# EasyEDA Pro project ProDocument_Original_2023-07-23.epro

# Schematic Schematic1_1
Create Date: 2023-07-10; Page Name: P1; Project Name: 39CASTIC; Schematic Name: Schematic1_1; Update Date: 2023-07-20; Add into BOM: yes; Company: 深圳嘉立创科技发展有限公司; Convert to PCB: yes; Drawed: 嘉立创EDA; Page Size: A3; Part Number: JLCPCB-001; Reviewed: 嘉立创EDA; Version: V0.1
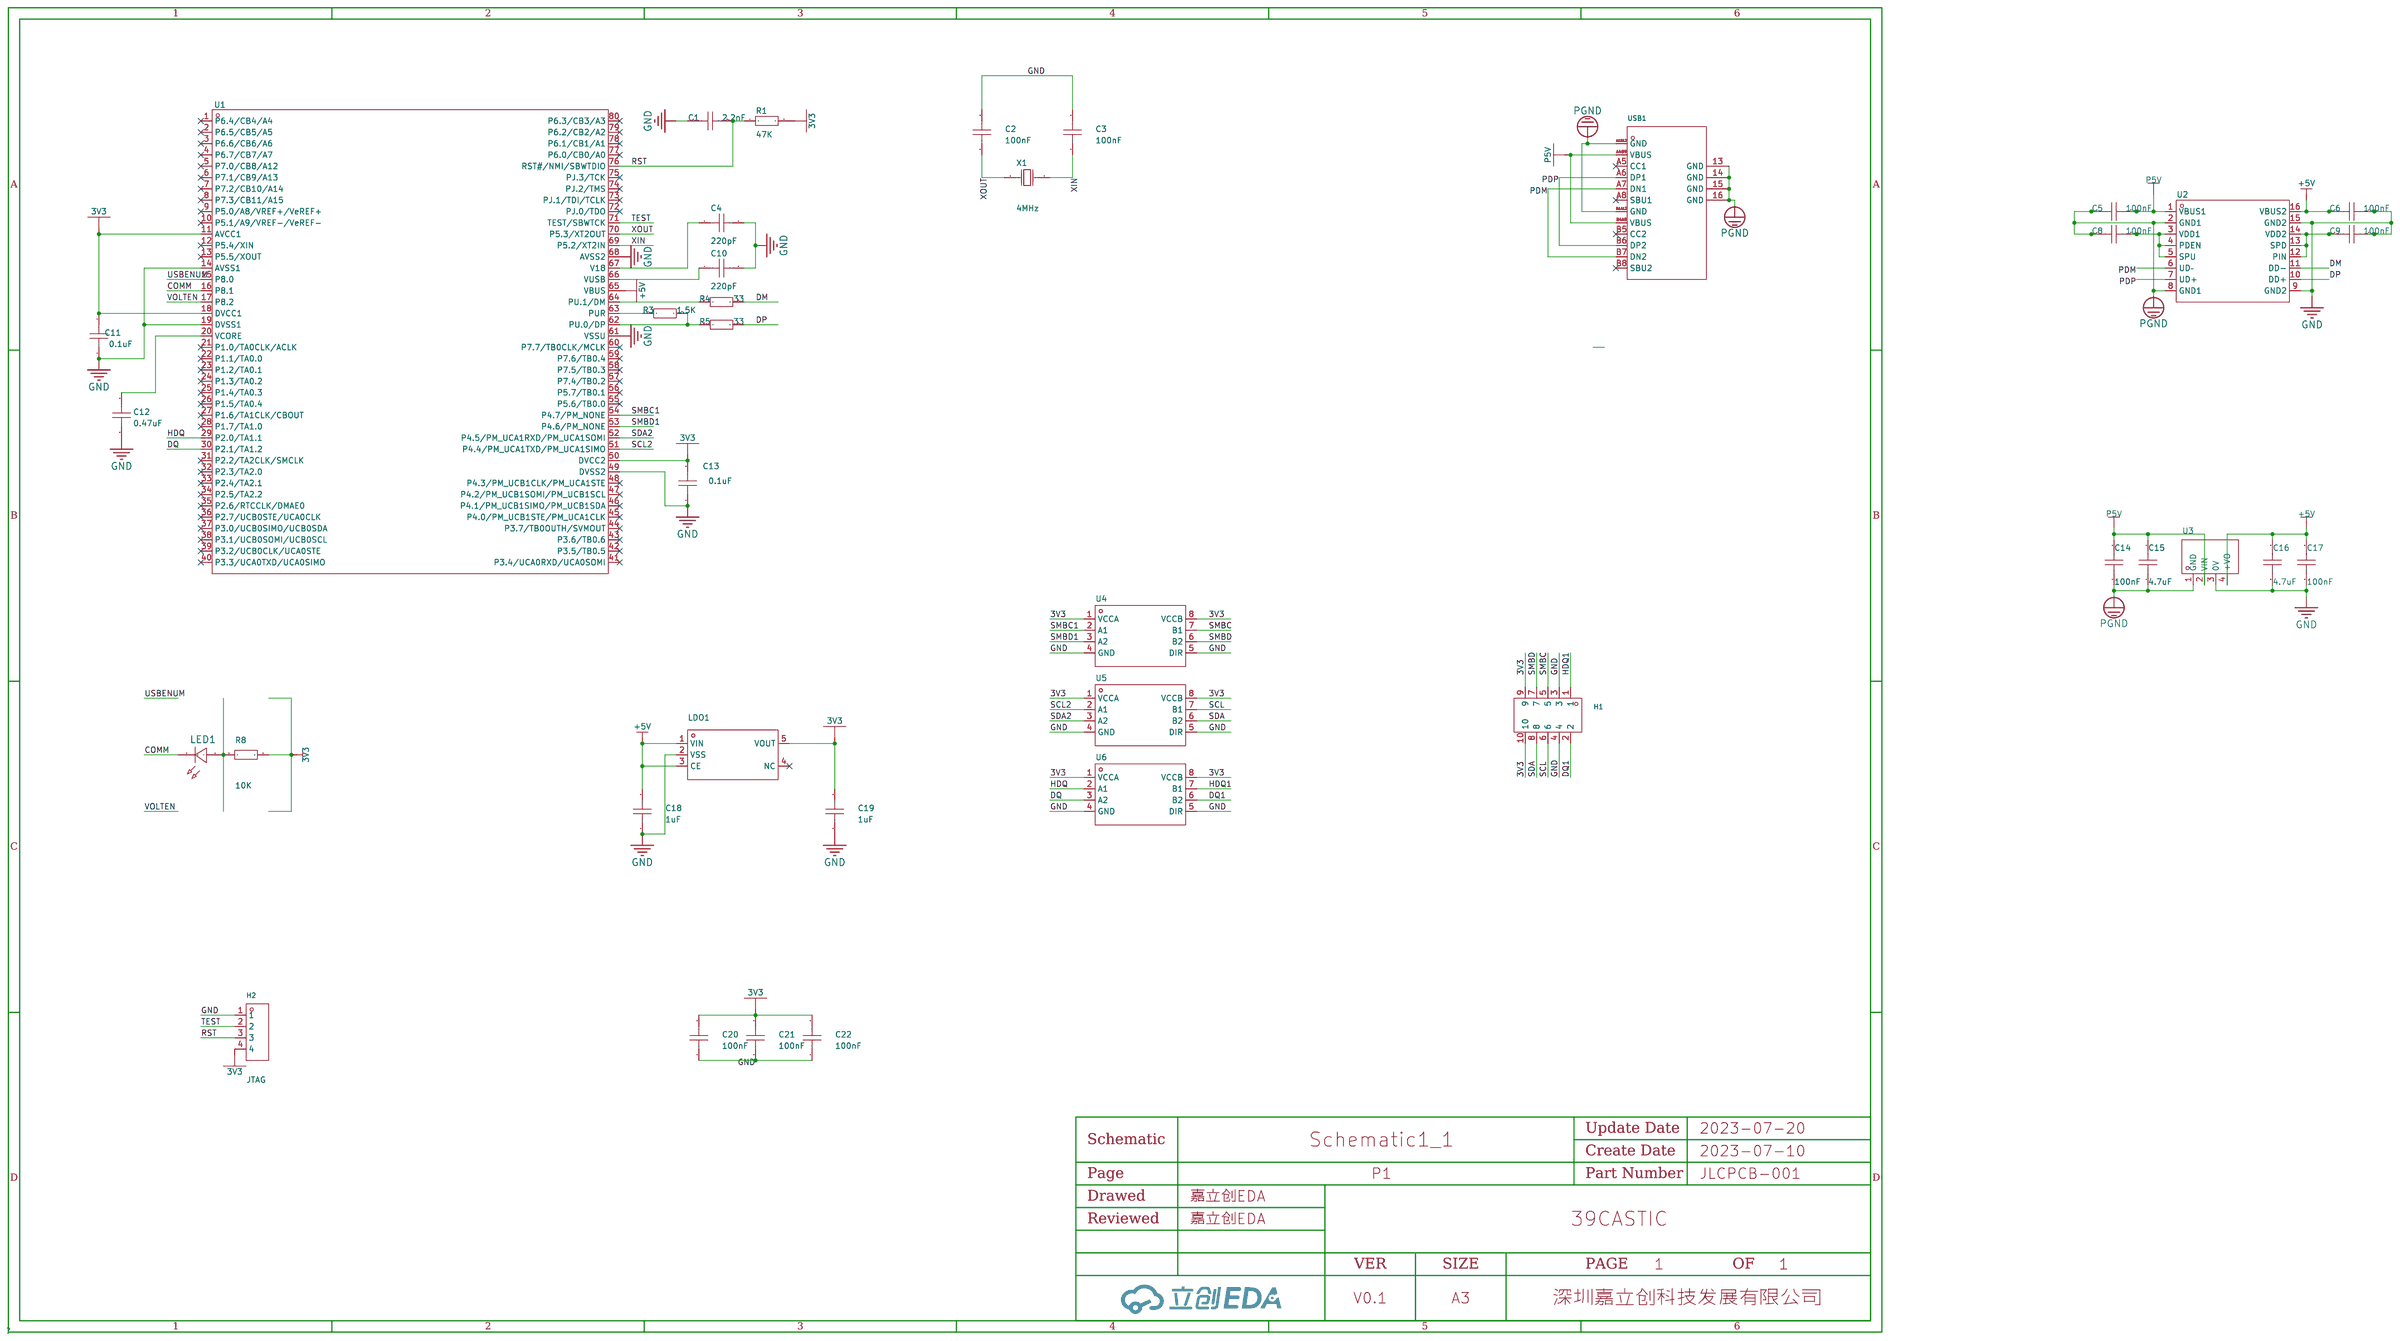
[diagram p0: schematic sheet]

## Parts
C1  2.2nF  [C0603_1]
C2  100nF  [C0603]
C3  100nF  [C0603]
C4  220pF  [C0603_1]
C5  100nF  [C0603]
C6  100nF  [C0603]
C8  100nF  [C0603]
C9  100nF  [C0603]
C10  220pF  [C0603_1]
C11  0.1uF  [C0603_1]
C12  0.47uF  [C0603_1]
C13  0.1uF  [C0603_1]
C14  100nF  [C0603]
C15  4.7uF  [C0603]
C16  4.7uF  [C0603]
C17  100nF  [C0603]
C18  1uF  [C0603]
C19  1uF  [C0603]
C20  100nF  [C0603]
C21  100nF  [C0603]
C22  100nF  [C0603]
H1  PZ254V-12-10P  [HDR-TH_10P-P2.54-V-M-R2-C5-S2.54]
H2  JTAG  [HDR-TH_4P-P2.54-V-F]
LDO1  ME6211C33M5G-N  [SOT-23-5_L3.0-W1.7-P0.95-LS2.8-BL]
LED1  -  [LED_0603]
R1  47K  [R0603_1]
R3  1.5K  [R0603_1]
R4  33  [R0603_1]
R5  33  [R0603_1]
R8  10K  [R0603]
U1  -  [LQFP-80_L12.0-W12.0-P0.50-LS14.0-BL]
U2  ADUM3160BRWZ-RL  [SOIC-16_L10.3-W7.5-P1.27-LS10.3-BL]
U3  B0505S-1W  [PWRM-TH_B0505S-1W]
U4  SN74LVC2T45DCUR  [VSSOP-8_L2.4-W2.1-P0.50-LS3.2-BR]
U5  SN74LVC2T45DCUR  [VSSOP-8_L2.4-W2.1-P0.50-LS3.2-BR]
U6  SN74LVC2T45DCUR  [VSSOP-8_L2.4-W2.1-P0.50-LS3.2-BR]
USB1  TYPEC-304-BCP16  [USB-C-SMD_TYPEC-304-BCP16]
X1  4MHz  [HC-49US_L11.5-W4.5-P4.88]

## Library data of the parts
C1 C4 C10-C13 = CAP_604: 容值:100nF;精度:±10%;额定电压:50V;温度系数:X7R;; Supplier Footprint: 0603
C2 C3 C5 C6 C8 C9 C14-C22 = CAP_0603: Supplier Footprint: 0603
H1 = PZ254V-12-10P: 排数:双排;总PIN位数:10;间距:2.54mm;插针结构:2x5P;行距:2.54mm;安装类型:直插;圆针/方针:方针;额定电流:-;额定电压:-;配合针长度:6mm;塑高:2.5mm;端接针长度:3mm;触头材质:黄铜;触头镀层:-;工作温度范围:-40℃~+105℃;颜色:黑色;; LCSC Part Name: 2.54mm 2x5P 直插 方针; Supplier Part: C492422; Manufacturer: XFCN(兴飞); Supplier Footprint: 直插,P=2.54mm; JLCPCB Part Class: 扩展库; Supplier: LCSC; Number of Rows: 双排; Number of Pins: 10; Pitch: 2.54mm; Pin Structure: 2x5P; Row Spacing: 2.54mm; Mounting Type: 直插; Circluar Pins/Square Pins: 方针; Length of Mating Pin: 6mm; Insulation Height: 2.5mm; Length of End Connection Pin: 3mm; Contact Material: 黄铜; Operating Temperature Range: -40℃~+105℃; Color: 黑色
H2 = HDR-F_2.54_1x4P: Supplier Part: C2718488; Supplier Footprint: 插件
LDO1 = ME6211C33M5G-N: 输出类型:固定;输出极性:正;最大输入电压:6V;输出电压:3.3V;输出电流:500mA;电源纹波抑制比(PSRR):70dB;; Supplier Part: C82942; Manufacturer: MICRONE(南京微盟); Supplier Footprint: SOT-23-5; JLCPCB Part Class: 扩展库; Datasheet: https://atta.szlcsc.com/upload/public/pdf/source/20170918/C82942_1505727073070976520.pdf; Supplier: LCSC; Output Type: 固定; Output Polarity: 正; Number of Outputs: 1; Maximum Input Voltage: 6V; Output Voltage: 3.3V; Dropout Voltage: 260mV@(200mA); Output Current: 500mA; Power Supply Rejection Ratio (PSRR): 70dB
LED1 = LED_0603-R: Supplier Footprint: 0603
R1 R3-R5 = Res_604: Supplier Footprint: 0603
R8 = Res_0603: Supplier Footprint: 0603
U1 = MSP430F5529IPN: CPU位数:-;ROM类型:-;CPU内核:-;主频（MAX):-;工作电压:-;; Supplier Part: C75712; Manufacturer: TI(德州仪器); Supplier Footprint: LQFP-80; JLCPCB Part Class: Extended Part; Datasheet: https://atta.szlcsc.com/upload/public/pdf/source/20180528/C75712_042792AAA7951DA6306D06E7842A7EC0.pdf; Supplier: LCSC
U2 = ADUM3160BRWZ-RL: 隔离器的技术构架:-;类型:-;通道数:-;通道类型:-;隔离电压:-;数据速率:-;; Supplier Part: C284149; Manufacturer: ADI(亚德诺)/LINEAR(凌特); Supplier Footprint: SOIC-16; JLCPCB Part Class: 扩展库; Datasheet: https://atta.szlcsc.com/upload/public/pdf/source/20180910/C284149_11FBD45D63BF8FE73FB2D6895B6D3DA5.pdf; Supplier: LCSC
U3 = B0505S-1W: 电压输出的组数:1;最大输入电压:5.5V;输出电压:5V;输出电流（最大值/满载）:200mA;; LCSC Part Name: DC-DC电源模块; Supplier Part: C2912568; Manufacturer: 德旭电子(DEXU); Supplier Footprint: 插件; JLCPCB Part Class: 扩展库; Datasheet: https://atta.szlcsc.com/upload/public/pdf/source/20211027/5CA00AAE5BD3B5061BF0CC10C720A2B7.pdf; Supplier: LCSC; Type: DC-DC隔离模块; Number of Outputs: 1; Voltage - Input (Min): 4.5V; Voltage - Input (Max): 5.5V; Voltage - Output: 5V; Current - Output(Max): 200mA; Voltage - Isolation: 1.5kVDC
U4-U6 = SN74LVC2T45DCUR: SN74LVC2T45 具有可配置电压转换和三态输出的 2 位双电源总线收发器; Supplier Part: C15741; Manufacturer: TI(德州仪器); Supplier Footprint: VSSOP-8-0.5mm; JLCPCB Part Class: Extended Part; Datasheet: https://atta.szlcsc.com/upload/public/pdf/source/20140711/1457707145874.pdf; Supplier: LCSC
USB1 = TYPEC-304-BCP16_C720629: 连接器类型:Type-C;标准:USB 3.1;公母:母座;触点数量:16;端口数量:1;安装方式:卧贴;额定电流 - 电源:3A;工作温度范围:-25℃~+85℃;焊接温度(最大值):260℃;; LCSC Part Name: Type-C 母座 卧贴 停产; Supplier Part: C720629; Manufacturer: XUNPU(讯普); Supplier Footprint: SMD; JLCPCB Part Class: Extended Part; Supplier: LCSC; Connector Type: Type-C; Standard: USB 3.1; Gender: 母座; Number of Contacts: 16; Number of Ports: 1; Mounting Style: 卧贴; Current Rating - Power (Max): 3A; Operating Temperature Range: -25℃~+85℃; Welding Temperature (Max): 260℃
X1 = X49SD4MSD2SC: 频率:4MHz;频率公差:±20ppm;负载电容:20pF;; LCSC Part Name: 4MHz ±20ppm 20pF HC-49US; Supplier Part: C13761; Manufacturer: YXC(扬兴晶振); Supplier Footprint: HC-49S; JLCPCB Part Class: 扩展库; Datasheet: https://atta.szlcsc.com/upload/public/pdf/source/20210903/A997D130AE99CBB55D9024F9BE6DA174.pdf; Supplier: LCSC; Crystal Type: 49S晶振; Frequency Tolerance: ±20ppm; Frequency Stability: ±30ppm; Load Capacitance: 20pF; Operating Temperature: -20℃~+70℃

## Nets
3V3: C11.2 C13.2 C19.2 C20.2 C21.2 C22.2 H1.9 H1.10 H2.4 LDO1.5(VOUT) R1.2 R8.2 U1.11(AVCC1) U1.18(DVCC1) U1.50(DVCC2) U4.1(VCCA) U4.8(VCCB) U5.1(VCCA) U5.8(VCCB) U6.1(VCCA) U6.8(VCCB)
+5V: C6.1 C16.2 C17.2 C18.2 LDO1.1(VIN) LDO1.3(CE) U1.65(VBUS) U2.16(VBUS2) U3.4(+VO)
GND: C1.1 C2.2 C3.2 C4.2 C6.2 C9.2 C10.2 C11.1 C12.1 C13.1 C16.1 C17.1 C18.1 C19.1 C20.1 C21.1 C22.1 H1.3 H1.4 H2.1 LDO1.2(VSS) U1.14(AVSS1) U1.19(DVSS1) U1.49(DVSS2) U1.61(VSSU) U1.68(AVSS2) U2.9(GND2) U2.15(GND2) U3.3(0V) U4.4(GND) U4.5(DIR) U5.4(GND) U5.5(DIR) U6.4(GND) U6.5(DIR)
P5V: C5.2 C14.2 C15.2 U2.1(VBUS1) U3.2(VIN) USB1.A4B9(VBUS) USB1.B4A9(VBUS)
PGND: C5.1 C8.1 C14.1 C15.1 U2.2(GND1) U2.8(GND1) U3.1(GND) USB1.13(GND) USB1.14(GND) USB1.15(GND) USB1.16(GND) USB1.A1B12(GND) USB1.B1A12(GND)
COMM: LED1.1(C) U1.16(P8.1)
DM: R4.2 U2.11(DD-)
DP: R5.2 U2.10(DD+)
DQ: U1.30(P2.1/TA1.2) U6.3(A2)
DQ1: H1.2 U6.6(B2)
HDQ: U1.29(P2.0/TA1.1) U6.2(A1)
HDQ1: H1.1 U6.7(B1)
PDM: U2.6(UD–) USB1.A7(DN1) USB1.B7(DN2)
PDP: U2.7(UD+) USB1.A6(DP1) USB1.B6(DP2)
RST: C1.2 H2.3 R1.1 U1.76(RST#/NMI/SBWTDIO)
SCL: H1.6 U5.7(B1)
SCL2: U1.51(P4.4/PM_UCA1TXD/PM_UCA1SIMO) U5.2(A1)
SDA: H1.8 U5.6(B2)
SDA2: U1.52(P4.5/PM_UCA1RXD/PM_UCA1SOMI) U5.3(A2)
SMBC: H1.5 U4.7(B1)
SMBC1: U1.54(P4.7/PM_NONE) U4.2(A1)
SMBD: H1.7 U4.6(B2)
SMBD1: U1.53(P4.6/PM_NONE) U4.3(A2)
TEST: H2.2 U1.71(TEST/SBWTCK)
USBENUM: U1.15(P8.0)
VOLTEN: U1.17(P8.2)
XIN: C3.1 U1.69(P5.2/XT2IN) X1.1(OSC1)
XOUT: C2.1 U1.70(P5.3/XT2OUT) X1.2(OSC2)
$1N1515: C12.2 U1.20(VCORE)
$1N2214: R3.2 R5.1 U1.62(PU.0/DP)
$1N2405: R3.1 U1.63(PUR)
$1N2629: R4.1 U1.64(PU.1/DM)
$1N2974: C10.1 U1.66(VUSB)
$1N2990: C4.1 U1.67(V18)
$1N10159: C8.2 U2.3(VDD1) U2.4(PDEN) U2.5(SPU)
$1N10160: C9.1 U2.12(PIN) U2.13(SPD) U2.14(VDD2)
$1N11086: LED1.2(A) R8.1

Not connected (* = marked no-connect by the designer): LDO1 4(NC)*; U1 1(P6.4/CB4/A4)* 2(P6.5/CB5/A5)* 3(P6.6/CB6/A6)* 4(P6.7/CB7/A7)* 5(P7.0/CB8/A12)* 6(P7.1/CB9/A13)* 7(P7.2/CB10/A14)* 8(P7.3/CB11/A15)* 9(P5.0/A8/VREF+/VeREF+)* 10(P5.1/A9/VREF-/VeREF-)* 12(P5.4/XIN)* 13(P5.5/XOUT)* 21(P1.0/TA0CLK/ACLK)* 22(P1.1/TA0.0)* 23(P1.2/TA0.1)* 24(P1.3/TA0.2)* 25(P1.4/TA0.3)* 26(P1.5/TA0.4)* 27(P1.6/TA1CLK/CBOUT)* 28(P1.7/TA1.0)* 31(P2.2/TA2CLK/SMCLK)* 32(P2.3/TA2.0)* 33(P2.4/TA2.1)* 34(P2.5/TA2.2)* 35(P2.6/RTCCLK/DMAE0)* 36(P2.7/UCB0STE/UCA0CLK)* 37(P3.0/UCB0SIMO/UCB0SDA)* 38(P3.1/UCB0SOMI/UCB0SCL)* 39(P3.2/UCB0CLK/UCA0STE)* 40(P3.3/UCA0TXD/UCA0SIMO)* 41(P3.4/UCA0RXD/UCA0SOMI)* 42(P3.5/TB0.5)* 43(P3.6/TB0.6)* 44(P3.7/TB0OUTH/SVMOUT)* 45(P4.0/PM_UCB1STE/PM_UCA1CLK)* 46(P4.1/PM_UCB1SIMO/PM_UCB1SDA)* 47(P4.2/PM_UCB1SOMI/PM_UCB1SCL)* 48(P4.3/PM_UCB1CLK/PM_UCA1STE)* 55(P5.6/TB0.0)* 56(P5.7/TB0.1)* 57(P7.4/TB0.2)* 58(P7.5/TB0.3)* 59(P7.6/TB0.4)* 60(P7.7/TB0CLK/MCLK)* 72(PJ.0/TDO)* 73(PJ.1/TDI/TCLK)* 74(PJ.2/TMS)* 75(PJ.3/TCK)* 77(P6.0/CB0/A0)* 78(P6.1/CB1/A1)* 79(P6.2/CB2/A2)* 80(P6.3/CB3/A3)*; USB1 A5(CC1)* A8(SBU1)* B5(CC2)* B8(SBU2)*

# Board PCB1_1
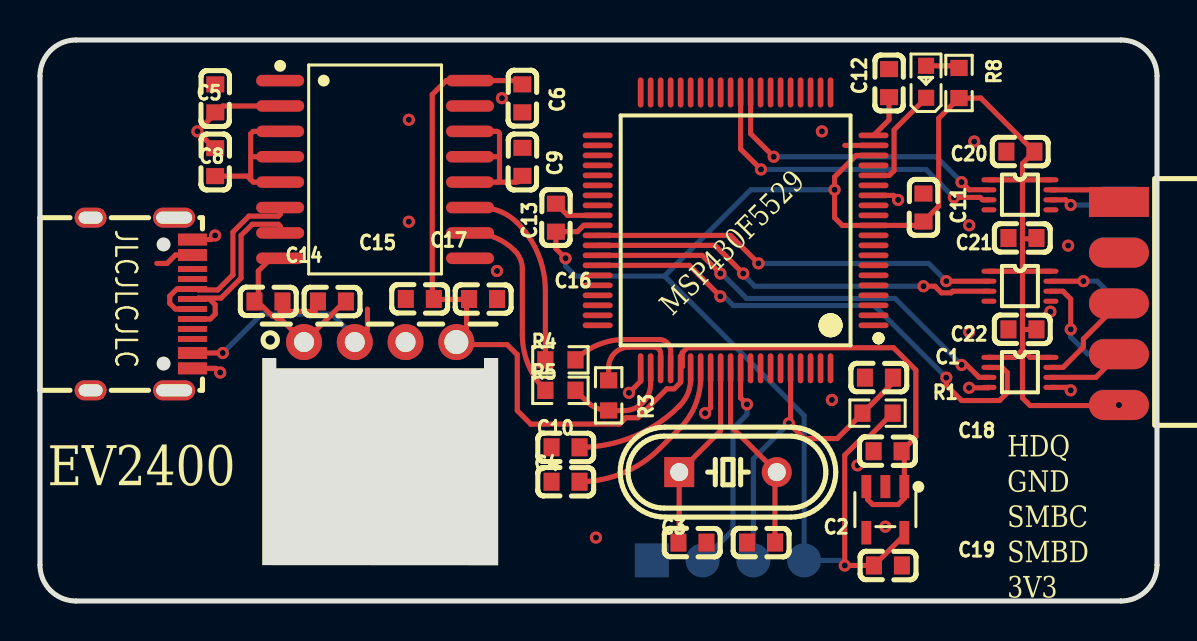
[diagram p1: board, top side]
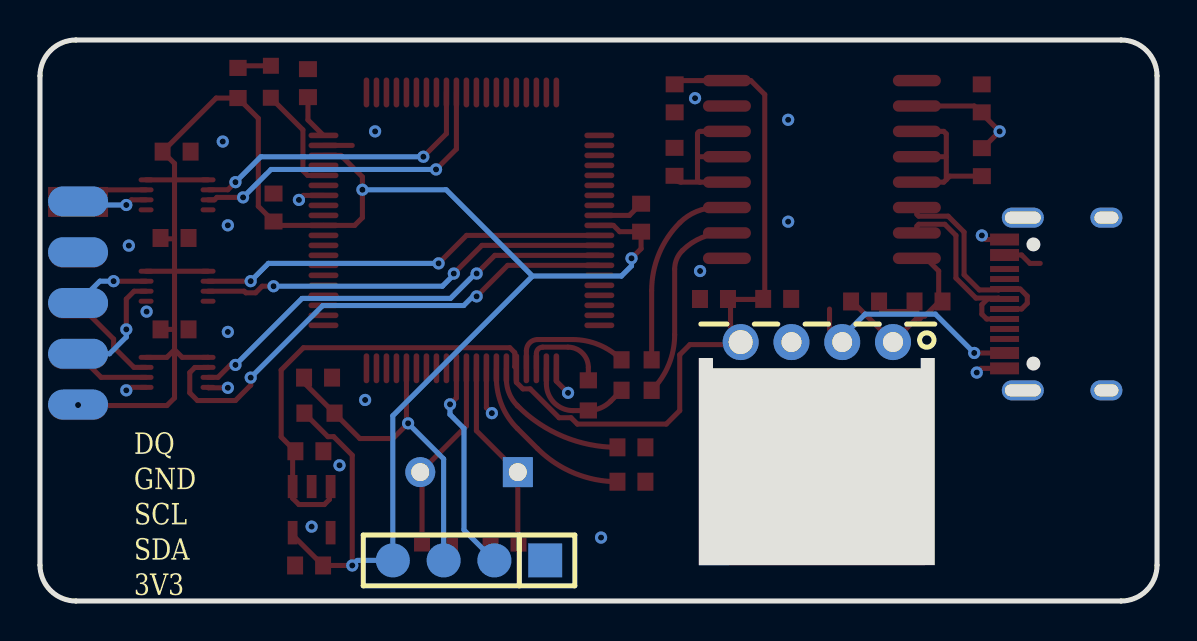
[diagram p2: board, bottom side, seen from below]

Outline 55.88 x 28.07 mm; copper layers: Top Layer, Bottom Layer. Coordinates in mm from the lower left corner of the outline.
Outline path: 0,26.27 0,1.8 arc(0.53,0.53) 1.8,0 54.08,0 arc(55.35,0.53) 55.88,1.8 55.88,26.27 arc(55.35,27.54) 54.08,28.07 1.8,28.07 arc(0.53,27.54) 0,26.27
Stack: Top Layer 0.035mm / Dielectric1 1.51mm FR4 er 4.5 / Bottom Layer 0.035mm

## Design rules (mm)
net DP: DP2
net DM: DP2
net PDP: DP1
net PDM: DP1
template: JLCPCB Capability(Two Layers Board)
spacing copperThickness1oz (default): track to track 0.102, other pairs 0.152 to 0.3
spacing copperThickness2oz: track to track 0.203, other pairs 0.152 to 0.3
track width copperThickness1oz (default): min 0.127, default 0.254, max 2.54
track width copperThickness2oz: min 0.203, default 0.254, max 2.54
differential pair differentialPair (default): width min 0.127, default 0.254, max 2.54; gap min 0.152, default 0.152
via viaSize (default): diameter min 0.5, default 0.61, max 10; hole min 0.3, default 0.305, max 6.3

## Placement (name value [footprint] x y rotation side)
C1  2.2nF  [C0603_1]  41.97 11.18 0 top
C2  100nF  [C0603]  36.07 2.93 180 top
C3  100nF  [C0603]  32.64 2.92 0 top
C4  220pF  [C0603_1]  26.29 5.97 180 top
C5  100nF  [C0603]  8.77 25.15 90 top
C6  100nF  [C0603]  24.13 25.15 270 top
C8  100nF  [C0603]  8.76 21.96 270 top
C9  100nF  [C0603]  24.14 21.97 90 top
C10  220pF  [C0603_1]  26.29 7.69 180 top
C11  0.1uF  [C0603_1]  44.2 19.68 270 top
C12  0.47uF  [C0603_1]  42.47 25.91 270 top
C13  0.1uF  [C0603_1]  25.81 19.18 270 top
C14  100nF  [C0603]  11.43 14.99 0 top
C15  4.7uF  [C0603]  14.61 14.99 180 top
C16  4.7uF  [C0603]  22.16 15.11 180 top
C17  100nF  [C0603]  19 15.11 0 top
C18  1uF  [C0603]  42.4 7.49 0 top
C19  1uF  [C0603]  42.42 1.78 180 top
C20  100nF  [C0603]  49.05 22.48 0 top
C21  100nF  [C0603]  49.15 18.16 0 top
C22  100nF  [C0603]  49.15 13.59 0 top
H1  PZ254V-12-10P  [HDR-TH_10P-P2.54-V-M-R2-C5-S2.54]  55.24 14.88 270 top
H2  JTAG  [HDR-TH_4P-P2.54-V-F]  34.42 2.03 0 bottom
LDO1  ME6211C33M5G-N  [SOT-23-5_L3.0-W1.7-P0.95-LS2.8-BL]  42.29 4.57 180 top
LED1  -  [LED_0603]  44.32 26.03 90 top
R1  47K  [R0603_1]  41.9 9.4 0 top
R3  1.5K  [R0603_1]  28.45 10.29 270 top
R4  33  [R0603_1]  26.04 12.06 180 top
R5  33  [R0603_1]  26.04 10.54 180 top
R8  10K  [R0603]  45.97 25.92 270 top
U1  -  [LQFP-80_L12.0-W12.0-P0.50-LS14.0-BL]  34.8 18.54 90 top
U2  ADUM3160BRWZ-RL  [SOIC-16_L10.3-W7.5-P1.27-LS10.3-BL]  16.76 21.59 270 top
U3  B0505S-1W  [PWRM-TH_B0505S-1W]  17.02 12.95 0 bottom
U4  SN74LVC2T45DCUR  [VSSOP-8_L2.4-W2.1-P0.50-LS3.2-BR]  49.02 11.44 180 top
U5  SN74LVC2T45DCUR  [VSSOP-8_L2.4-W2.1-P0.50-LS3.2-BR]  49.02 15.75 180 top
U6  SN74LVC2T45DCUR  [VSSOP-8_L2.4-W2.1-P0.50-LS3.2-BR]  49.02 20.32 180 top
USB1  TYPEC-304-BCP16  [USB-C-SMD_TYPEC-304-BCP16]  5.08 14.86 270 top
X1  4MHz  [HC-49US_L11.5-W4.5-P4.88]  34.42 6.45 0 top

## Footprints (pads in the part's own frame, mm; a bottom-side part is the same pattern mirrored in y, then rotated)
C0603
  rect 0.8x0.9 smd: 1(-0.7,0) 2(0.7,0)
C0603_1
  rect 0.8x0.9 smd: 1(-0.7,0) 2(0.7,0)
HC-49US_L11.5-W4.5-P4.88
  rect 1.5x1.5 hole 0.9: 1(-2.44,0)
  round 1.5 hole 0.9: 2(2.44,0)
HDR-TH_4P-P2.54-V-F
  rect 1.7x1.7 smd: 1(-3.81,0)
  round 1.7 smd: 2(-1.27,0) 3(1.27,0) 4(3.81,0)
HDR-TH_10P-P2.54-V-M-R2-C5-S2.54
  rect 1.5x3 smd: 1(-5.08,-1.27)
  oval 1.5x3 smd far side: 2(-5.106,-1.27) 4(-2.566,-1.27) 6(-0.025,-1.27) 8(2.514,-1.27) 10(5.054,-1.27)
  oval 1.5x3 smd: 3(-2.54,-1.27) 5(0,-1.27) 7(2.54,-1.27) 9(5.08,-1.27)
LED_0603
  rect 0.8x0.8 smd: 1(-0.851,-0.01) 2(0.75,-0.005)
LQFP-80_L12.0-W12.0-P0.50-LS14.0-BL
  oval 0.28x1.5 smd: 1(-4.75,-6.9) 2(-4.25,-6.9) 3(-3.75,-6.9) 4(-3.25,-6.9) 5(-2.75,-6.9) 6(-2.25,-6.9) 7(-1.75,-6.9) 8(-1.25,-6.9) 9(-0.75,-6.9) 10(-0.25,-6.9) 11(0.25,-6.9) 12(0.75,-6.9) 13(1.25,-6.9) 14(1.75,-6.9) 15(2.25,-6.9) 16(2.75,-6.9) 17(3.25,-6.9) 18(3.75,-6.9) 19(4.25,-6.9) 20(4.75,-6.9) 41(4.75,6.9) 42(4.25,6.9) 43(3.75,6.9) 44(3.25,6.9) 45(2.75,6.9) 46(2.25,6.9) 47(1.75,6.9) 48(1.25,6.9) 49(0.75,6.9) 50(0.25,6.9) 51(-0.25,6.9) 52(-0.75,6.9) 53(-1.25,6.9) 54(-1.75,6.9) 55(-2.25,6.9) 56(-2.75,6.9) 57(-3.25,6.9) 58(-3.75,6.9) 59(-4.25,6.9) 60(-4.75,6.9)
  oval 1.5x0.28 smd: 21(6.9,-4.75) 22(6.9,-4.25) 23(6.9,-3.75) 24(6.9,-3.25) 25(6.9,-2.75) 26(6.9,-2.25) 27(6.9,-1.75) 28(6.9,-1.25) 29(6.9,-0.75) 30(6.9,-0.25) 31(6.9,0.25) 32(6.9,0.75) 33(6.9,1.25) 34(6.9,1.75) 35(6.9,2.25) 36(6.9,2.75) 37(6.9,3.25) 38(6.9,3.75) 39(6.9,4.25) 40(6.9,4.75) 61(-6.9,4.75) 62(-6.9,4.25) 63(-6.9,3.75) 64(-6.9,3.25) 65(-6.9,2.75) 66(-6.9,2.25) 67(-6.9,1.75) 68(-6.9,1.25) 69(-6.9,0.75) 70(-6.9,0.25) 71(-6.9,-0.25) 72(-6.9,-0.75) 73(-6.9,-1.25) 74(-6.9,-1.75) 75(-6.9,-2.25) 76(-6.9,-2.75) 77(-6.9,-3.25) 78(-6.9,-3.75) 79(-6.9,-4.25) 80(-6.9,-4.75)
PWRM-TH_B0505S-1W
  round 1.8 hole 1: 1(-3.81,0) 2(-1.27,0) 3(1.27,0)
  round 1.8 hole 1.2: 4(3.81,0)
R0603
  rect 0.806x0.864 smd: 1(-0.753,0) 2(0.753,0)
R0603_1
  rect 0.806x0.864 smd: 1(-0.753,0) 2(0.753,0)
SOIC-16_L10.3-W7.5-P1.27-LS10.3-BL
  oval 0.574x2.401 smd: 1(-4.445,-4.75) 2(-3.175,-4.75) 3(-1.905,-4.75) 4(-0.635,-4.75) 5(0.635,-4.75) 6(1.905,-4.75) 7(3.175,-4.75) 8(4.445,-4.75) 9(4.445,4.75) 10(3.175,4.75) 11(1.905,4.75) 12(0.635,4.75) 13(-0.635,4.75) 14(-1.905,4.75) 15(-3.175,4.75) 16(-4.445,4.75)
SOT-23-5_L3.0-W1.7-P0.95-LS2.8-BL
  rect 0.49x1.157 smd: 1(-0.95,-1.153) 2(0,-1.153) 3(0.95,-1.153)
  rect 0.49x1.175 smd: 4(0.95,1.153) 5(-0.95,1.153)
USB-C-SMD_TYPEC-304-BCP16
  oval 1x2.1 hole 0.6x1.8: 13(-4.32,1.633) 14(4.32,1.633)
  oval 1x1.6 hole 0.6x1.2: 15(-4.32,-2.547) 16(4.32,-2.547)
  rect 0.6x1.45 smd: A1B12(-3.225,2.547) A4B9(-2.45,2.547) B1A12(3.22,2.547) B4A9(2.45,2.547)
  rect 0.3x1.45 smd: A5(-1.25,2.547) A6(-0.25,2.547) A7(0.25,2.547) A8(1.25,2.547) B5(1.75,2.547) B6(0.75,2.547) B7(-0.75,2.547) B8(-1.75,2.547)
VSSOP-8_L2.4-W2.1-P0.50-LS3.2-BR
  oval 0.75x0.25 smd: 1(1.55,-0.75) 2(1.55,-0.25) 3(1.55,0.25) 4(1.55,0.75) 5(-1.55,0.75) 6(-1.55,0.25) 7(-1.55,-0.25) 8(-1.55,-0.75)

## Nets
As in the schematic.

Pads without a net: LDO1 4; U1 1 2 3 4 5 6 7 8 9 10 12 13 21 22 23 24 25 26 27 28 31 32 33 34 35 36 37 38 39 40 41 42 43 44 45 46 47 48 55 56 57 58 59 60 72 73 74 75 77 78 79 80; USB1 A5 A8 B5 B8

## Via types
v1: diameter 0.61, hole 0.305, Top Layer to Bottom Layer, 44 vias

## Routing (per net, layer and track width the routed paths; a pad name or vN(x,y) marks a point on that pad's centre or on a via; arc(x,y) is an arc through that point)
3V3: length 101
  Top Layer w0.254: 49.15,16.5 49.15,13.61 ; 49.15,16.5 U5.8 ; 49.15,16.5 U5.1 ; 49.15,16.5 49.15,18.12 ; 49.15,13.61 49.17,13.59 C22.2 ; 49.15,13.61 49.15,12.57 ; 49.15,21.07 49.15,21.89 C20.2 47.06,25.16 R8.2 44.96,24.15 44.96,19.75 C11.2 ; 49.15,21.07 49.15,18.12 ; 49.15,21.07 U6.1 ; 49.15,21.07 U6.8 ; C21.2 49.81,18.12 49.15,18.12 ; v1(53.98,9.8) 53.95,9.78 49.53,9.78 49.15,10.16 49.15,12.57 ; U4.1 47.48,12.19 48.77,12.19 49.15,12.57 ; v1(26.29,17.14) 25.81,17.62 C13.2 26.88,18.48 27.2,18.79 U1.50 ; LDO1.5 43.24,3.3 C19.2 v1(40.26,1.78) 40.26,7.29 41.19,8.22 41.48,8.22 R1.2 ; 49.15,12.57 49.53,12.19 U4.8 ; U1.18 40.83,22.29 39.75,21.22 v1(39.75,20.57) 39.75,19.18 40.14,18.79 U1.11 44.13,18.79 44.32,18.98
  Bottom Layer w0.254: v1(39.75,20.57) 35.56,20.57 31.24,16.26 ; v1(40.26,1.78) 40.01,2.03 H2.4 38.23,9.27 31.24,16.26 ; 31.24,16.26 26.8,16.26 26.29,16.76 v1(26.29,17.14)
+5V: length 57.9
  Top Layer w0.254: 41.34,5.73 41.4,5.66 41.4,5.08 41.66,4.83 42.93,4.83 43.24,5.14 LDO1.1 43.24,7.35 C18.2 43.82,8.21 43.82,11.56 42.7,12.67 32.37,12.67 32.13,12.43 32.13,11.72 U1.65 32.05,10.94 31.72,10.61 31.36,10.61 29.91,9.17 29.31,9.17 29,8.85 24.55,8.85 23.88,9.52 23.88,12.32 23.37,12.83 21.08,12.83 ; 21.08,12.83 21.34,13.08 21.34,15.09 19.62,15.09 19.62,25.34 20.32,26.03 U2.16 23.94,26.03 arc(24.08,25.98) C6.1 ; 21.08,12.83 20.95,12.83 U3.4
GND: length 11
  Top Layer w0.254: v1(42.93,20.07) 42.7,20.29 U1.14 ; v1(46.48,10.67) 47.45,10.67 U4.4 ; U4.5 51.41,10.69 v1(51.56,10.54) ; v1(29.46,10.41) 30.05,11 U1.61 ; U1.19 40.26,22.79 ; U1.68 33.55,9.67 v1(33.27,9.4) ; U1.49 26.39,19.29 C13.1
  vias: v1(18.45,24.07) v1(18.45,18.98) v1(22.86,16.51) v1(23.11,25.16) v1(27.81,3.17) v1(39.12,23.49) v1(39.61,10.06) v1(40.9,6.79) v1(42.29,3.72) v1(46.48,18.8) v1(46.48,13.46) v1(46.74,22.99) v1(50.55,14.48) v1(51.43,17.78)
P5V: length 16
  Top Layer w0.254: USB1.B4A9 v1(9.14,12.41) ; U3.2 16.38,13.59 16.38,14.6 ; USB1.A4B9 6.78,17.31 6.36,16.89 5.84,16.89 ; 12,14.48 13.78,14.48
  Bottom Layer w0.254: 15.62,12.19 15.62,13.33 14.61,14.35 11.09,14.35 v1(9.14,12.41)
PGND: length 17.9
  Top Layer w0.254: v1(8.76,18.29) 8.56,18.08 USB1.A1B12 ; v1(9.02,11.43) 8.81,11.64 USB1.B1A12 ; 8.77,24.39 9.14,24.77 U2.2 ; 8.77,24.39 C5.1 ; 8.77,24.39 v1(7.87,23.49) 8.71,22.66 C8.1 ; C15.1 15.24,14.99 U3.1 12.03,14.13 11.86,14.13 11.73,14.26 11.61,14.26 10.89,14.99 C14.1 10.92,15.18 10.92,16.51 11.56,17.14 U2.8
COMM: length 5.4
  Top Layer w0.254: U1.16 42.49,21.29 42.73,21.53 42.73,23.57 LED1.1
DM: length 9.8
  Top Layer w0.254: U2.11 22.04,19.68 arc(23.03,19.49) 23.88,18.92 arc(24.92,17.37) 25.28,15.53 R4.2
DP: length 9.9
  Top Layer w0.254: U2.10 21.6,18.41 arc(22.76,18.18) 23.75,17.53 arc(24.03,17.1) 24.13,16.61 24.13,13.32 arc(24.43,11.82) R5.2
DQ: length 16.3
  Top Layer w0.254: U1.30 35.05,22.61 v1(36.07,21.59) ; v1(45.72,20.19) 47.03,20.19 47.15,20.07 U6.3
  Bottom Layer w0.254: v1(36.07,21.59) 44.32,21.59 v1(45.72,20.19)
DQ1: length 3.6
  Top Layer w0.254: U6.6 51.3,20.07 v1(51.56,19.81)
  Bottom Layer w0.254: v1(51.56,19.81) 53.8,19.81 53.98,19.99
HDQ: length 15.1
  Top Layer w0.254: v1(36.7,22.22) 35.55,23.38 U1.29 ; v1(46.1,20.95) 46.48,20.57 47.43,20.57
  Bottom Layer w0.254: v1(36.7,22.22) 44.83,22.22 v1(46.1,20.95)
HDQ1: length 3.7
  Top Layer w0.254: 53.98,19.96 53.37,20.57 U6.7
PDM: length 10.5
  Top Layer w0.254: U2.6 12.01,19.34 11.92,19.25 10.45,19.25 9.65,18.46 9.65,16.32 8.89,15.56 7.93,15.56 7.88,15.61 USB1.B7 6.85,15.61 6.49,15.25 6.49,14.89 6.78,14.61 USB1.A7
PDP: length 10.3
  Top Layer w0.254: USB1.A6 7.88,15.11 ; 7.88,15.11 8.48,15.11 8.76,14.83 8.76,14.35 8.52,14.11 USB1.B6 ; 7.88,15.11 7.93,15.16 9.06,15.16 10.06,16.16 10.06,18.29 10.62,18.85 11.92,18.85 12.01,18.76 U2.7
RST: length 17.3
  Top Layer w0.254: 41.14,9.39 42.67,10.92 C1.2 ; 41.14,9.39 R1.1 ; 41.14,9.39 39.88,8.13 38.23,8.13 v1(37.46,8.89) 37.55,8.97 U1.76
  Bottom Layer w0.254: H2.3 35.69,7.11 v1(37.46,8.89)
SCL: length 3.9
  Top Layer w0.254: v1(52.2,16) 52.19,16 U5.7
  Bottom Layer w0.254: v1(52.2,16) 52.88,16 53.98,14.91
SCL2: length 20.5
  Top Layer w0.254: v1(35.94,16.89) 34.54,18.29 U1.51 ; v1(45.34,16) 45.34,16 U5.2
  Bottom Layer w0.254: v1(35.94,16.89) 44.45,16.89 v1(45.34,16)
SDA: length 5.8
  Top Layer w0.254: v1(51.56,13.59) 51.56,15.11 51.17,15.5 U5.6
  Bottom Layer w0.254: v1(51.56,13.59) 51.56,13.21 52.4,12.37 53.98,12.37
SDA2: length 20.6
  Top Layer w0.254: U5.3 45.66,15.5 45.58,15.42 45.1,15.42 44.77,15.75 v1(44.2,15.75) ; v1(35.18,16.38) 33.77,17.79 U1.52
  Bottom Layer w0.254: v1(44.2,15.75) 35.75,15.75 35.18,16.32 v1(35.18,16.38)
SMBC: length 5
  Top Layer w0.254: 53.98,14.88 52.2,13.1 52.2,12.7 51.18,11.69 U4.7
SMBC1: length 25.7
  Top Layer w0.254: U4.2 47.48,11.68 48.13,11.68 48.39,11.43 48.39,10.41 48,10.03 46.1,10.03 45.34,10.8 v1(45.34,11.18) ; v1(34.04,15.24) 32.48,16.79 U1.54
  Bottom Layer w0.254: v1(34.04,15.24) 34.23,15.24 34.68,14.78 41.73,14.78 v1(45.34,11.18)
SMBD: length 3.9
  Top Layer w0.254: 53.98,12.34 52.82,11.19 U4.6
SMBD1: length 22.1
  Top Layer w0.254: v1(46.1,11.81) 46.36,11.81 46.98,11.19 U4.3 ; U1.53 33.13,17.29 v1(34.04,16.38)
  Bottom Layer w0.254: v1(46.1,11.81) 42.77,15.14 35.34,15.14 34.1,16.38 v1(34.04,16.38)
TEST: length 10.7
  Top Layer w0.254: v1(35.37,9.84) 35.05,10.16 U1.71
  Bottom Layer w0.254: 33.15,2.03 34.67,3.56 34.67,8.64 35.37,9.33 v1(35.37,9.84)
XIN: length 9.6
  Top Layer w0.254: U1.69 34.05,8.52 X1.1 31.98,2.96 C3.1
XOUT: length 9.7
  Top Layer w0.254: U1.70 34.55,8.76 X1.2 36.77,6.36 C2.1
$1N1515: length 2.2
  Top Layer w0.254: C12.2 42.47,24.07 U1.20
$1N2214: length 5.7
  Top Layer w0.254: R5.1 27.33,9.99 arc(27.85,9.65) R3.2 arc(28.45,9.53) 28.46,9.52 29.21,9.52 arc(30.16,9.92) 30.55,10.86 U1.62
$1N2405: length 4.7
  Top Layer w0.254: U1.63 31.05,12.39 arc(30.96,12.61) 30.73,12.7 29.46,12.7 arc(28.75,12.4) 28.45,11.68 R3.1
$1N2629: length 6.2
  Top Layer w0.254: U1.64 31.55,12.52 arc(31.38,12.92) 30.99,13.08 29.24,13.08 arc(27.91,12.82) R4.1
$1N2974: length 7.6
  Top Layer w0.254: U1.66 32.55,11.09 arc(32.41,10.38) 32,9.78 31.98,9.75 arc(29.69,8.23) C10.1
$1N2990: length 9.2
  Top Layer w0.254: U1.67 33.05,11.16 arc(32.78,9.79) 32,8.64 30.99,7.63 arc(29.16,6.4) C4.1
$1N10159: length 8.7
  Top Layer w0.254: 10.54,21.08 10.67,20.95 U2.5 ; 10.54,21.08 10.54,23.37 10.67,23.49 U2.3 ; 10.54,21.08 10.37,21.26 C8.2 ; U2.4 10.54,22.22
$1N10160: length 8.3
  Top Layer w0.254: 22.99,22.26 22.99,23.37 arc(22.95,23.46) 22.86,23.49 U2.14 ; 22.99,22.26 22.99,21.08 arc(22.95,20.99) 22.86,20.95 ; 22.99,22.26 arc(22.98,22.24) 22.95,22.22 U2.13 ; 22.86,20.95 23.82,20.95 arc(24.04,21.05) C9.1 ; 22.86,20.95 U2.12
$1N11086: length 1.7
  Top Layer w0.254: R8.1 45.87,26.78 LED1.2

## Copper pours and planes (outline as drawn; the poured copper is in the pictures)
GND on Top Layer: 17.4,31.24 63.75,31.24 63.75,-3.56 17.4,-3.56
GND on Bottom Layer: 17.34,31.24 63.69,31.24 63.69,-3.56 17.34,-3.56
P5V on Top Layer: -3.68,30.99 16.89,30.99 16.89,-1.69 -3.68,-1.69
PGND on Bottom Layer: -3.68,30.05 16.89,30.05 16.89,-2.62 -3.68,-2.62

## Text on the board
Bottom Silkscreen Layer: DQ / GND / SCL / SDA / 3V3
Top Silkscreen Layer: JLCJLCJLC | HDQ / GND / SMBC / SMBD / 3V3 | MSP430F5529 | EV2400
